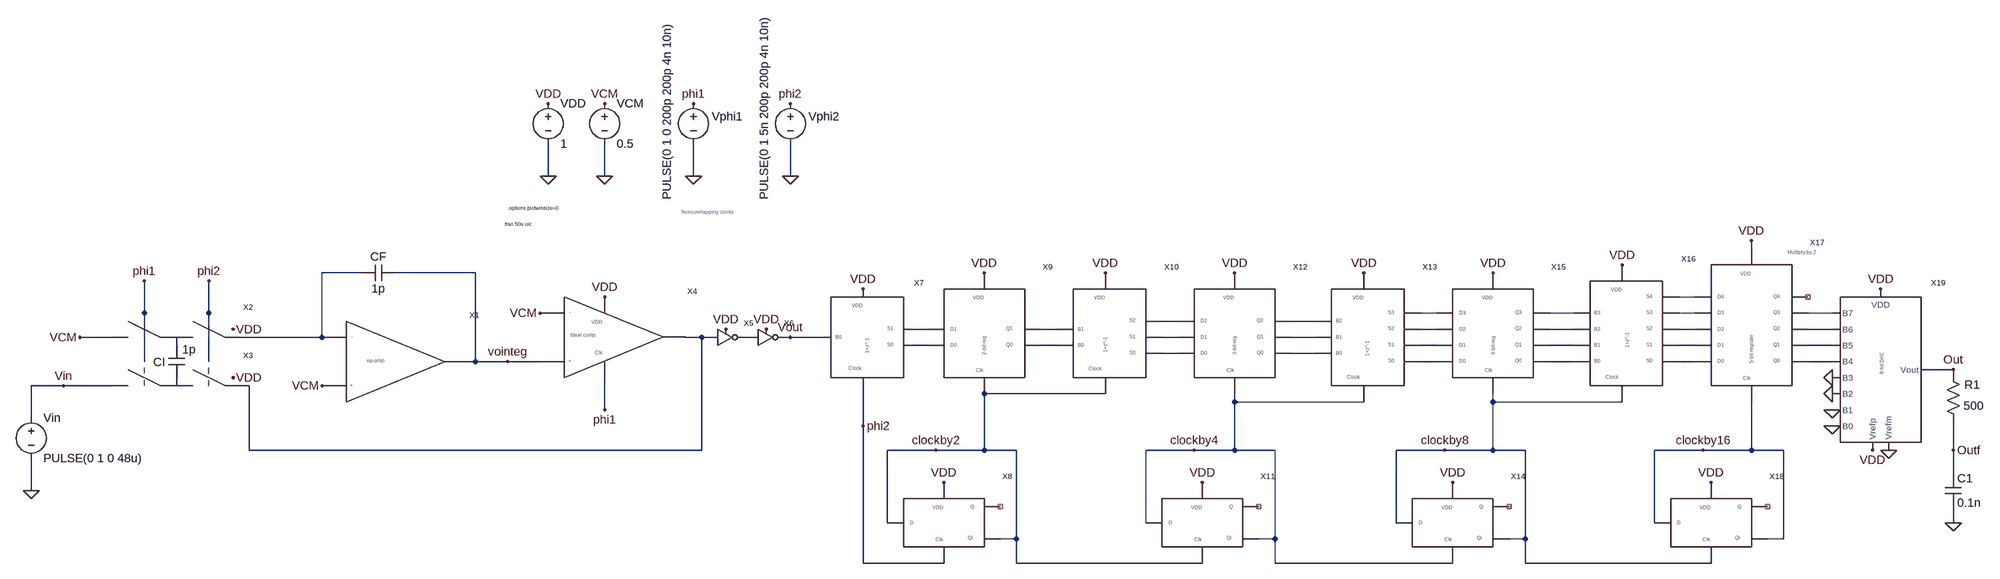
[diagram p0: schematic _Fig7_3_w_digital_filter_MSD.asc]
_Fig7_3_w_digital_filter_MSD.asc, the LTspice schematic file:
Version 4
SHEET 1 4592 696
WIRE 1744 -704 1744 -768
WIRE 1856 -704 1856 -768
WIRE 2032 -704 2032 -768
WIRE 2224 -704 2224 -768
WIRE 4128 -560 4128 -576
WIRE 1376 -512 1296 -512
WIRE 1600 -512 1440 -512
WIRE 4016 -464 3984 -464
WIRE 944 -432 944 -496
WIRE 1072 -432 1072 -496
WIRE 3504 -432 3472 -432
WIRE 3776 -432 3728 -432
WIRE 4016 -432 3984 -432
WIRE 4288 -432 4240 -432
WIRE 2992 -416 2960 -416
WIRE 3264 -416 3216 -416
WIRE 2496 -400 2464 -400
WIRE 2752 -400 2720 -400
WIRE 3504 -400 3472 -400
WIRE 3776 -400 3728 -400
WIRE 4016 -400 3984 -400
WIRE 4288 -400 4240 -400
WIRE 880 -384 816 -384
WIRE 1296 -384 1296 -512
WIRE 1296 -384 1136 -384
WIRE 2048 -384 2016 -384
WIRE 2080 -384 2048 -384
WIRE 2160 -384 2128 -384
WIRE 2224 -384 2208 -384
WIRE 2288 -384 2224 -384
WIRE 2992 -384 2960 -384
WIRE 3264 -384 3216 -384
WIRE 1008 -368 1008 -384
WIRE 2496 -368 2464 -368
WIRE 2752 -368 2720 -368
WIRE 3504 -368 3472 -368
WIRE 3776 -368 3728 -368
WIRE 4016 -368 3984 -368
WIRE 4288 -368 4240 -368
WIRE 2992 -352 2960 -352
WIRE 3264 -352 3216 -352
WIRE 944 -336 944 -432
WIRE 1072 -336 1072 -432
WIRE 1600 -336 1600 -512
WIRE 1600 -336 1584 -336
WIRE 1664 -336 1600 -336
WIRE 1728 -336 1664 -336
WIRE 3504 -336 3472 -336
WIRE 3776 -336 3728 -336
WIRE 4016 -336 3984 -336
WIRE 4288 -336 4240 -336
WIRE 4528 -320 4480 -320
WIRE 4528 -304 4528 -320
WIRE 784 -288 720 -288
WIRE 880 -288 784 -288
WIRE 1008 -288 1008 -304
WIRE 1152 -288 1136 -288
WIRE 2848 -272 2608 -272
WIRE 3104 -256 3104 -272
WIRE 3360 -256 3104 -256
WIRE 3616 -256 3616 -272
WIRE 3872 -256 3616 -256
WIRE 1856 -240 1856 -304
WIRE 720 -224 720 -288
WIRE 2368 -208 2368 -288
WIRE 1152 -160 1152 -288
WIRE 2048 -160 2048 -384
WIRE 2048 -160 1152 -160
WIRE 2512 -160 2416 -160
WIRE 2608 -160 2608 -272
WIRE 2608 -160 2512 -160
WIRE 2672 -160 2608 -160
WIRE 3024 -160 2928 -160
WIRE 3104 -160 3104 -256
WIRE 3104 -160 3024 -160
WIRE 3184 -160 3104 -160
WIRE 3520 -160 3424 -160
WIRE 3616 -160 3616 -256
WIRE 3616 -160 3520 -160
WIRE 3680 -160 3616 -160
WIRE 4032 -160 3936 -160
WIRE 4128 -160 4128 -256
WIRE 4128 -160 4032 -160
WIRE 4192 -160 4128 -160
WIRE 4528 -160 4528 -224
WIRE 4528 -112 4528 -160
WIRE 720 -80 720 -144
WIRE 2416 -16 2416 -160
WIRE 2928 -16 2928 -160
WIRE 3424 -16 3424 -160
WIRE 3936 -16 3936 -160
WIRE 4528 -16 4528 -48
WIRE 2672 16 2672 -160
WIRE 2672 16 2640 16
WIRE 3184 16 3184 -160
WIRE 3184 16 3152 16
WIRE 3680 16 3680 -160
WIRE 3680 16 3648 16
WIRE 4192 16 4192 -160
WIRE 4192 16 4160 16
WIRE 2368 64 2368 -208
WIRE 2528 64 2368 64
WIRE 2672 64 2672 16
WIRE 3040 64 2672 64
WIRE 3184 64 3184 16
WIRE 3536 64 3184 64
WIRE 3680 64 3680 16
WIRE 4048 64 3680 64
FLAG 720 -80 0
FLAG 784 -288 Vin
FLAG 2032 -704 0
FLAG 2032 -848 phi1
FLAG 1744 -704 0
FLAG 1744 -848 VDD
FLAG 1120 -400 VDD
FLAG 1120 -304 VDD
FLAG 944 -496 phi1
FLAG 1072 -496 phi2
FLAG 1296 -288 VCM
FLAG 816 -384 VCM
FLAG 2224 -704 0
FLAG 2224 -848 phi2
FLAG 1856 -704 0
FLAG 1856 -848 VCM
FLAG 1728 -432 VCM
FLAG 1856 -464 VDD
FLAG 1856 -240 phi1
FLAG 1664 -336 vointeg
FLAG 2096 -400 VDD
FLAG 2176 -400 VDD
FLAG 2368 -480 VDD
FLAG 2528 -96 VDD
FLAG 2512 -160 clockby2
FLAG 2608 -512 VDD
FLAG 2848 -512 VDD
FLAG 3040 -96 VDD
FLAG 3024 -160 clockby4
FLAG 3104 -512 VDD
FLAG 3360 -512 VDD
FLAG 3536 -96 VDD
FLAG 3520 -160 clockby8
FLAG 3616 -512 VDD
FLAG 3872 -528 VDD
FLAG 4048 -96 VDD
FLAG 4032 -160 clockby16
FLAG 4128 -576 VDD
FLAG 4384 -480 VDD
FLAG 4368 -160 VDD
FLAG 4400 -160 0
FLAG 4288 -240 0
FLAG 4288 -208 0
FLAG 4528 -320 Out
FLAG 4528 -16 0
FLAG 4528 -160 Outf
FLAG 4288 -272 0
FLAG 2224 -384 Vout
FLAG 2368 -208 phi2
FLAG 4288 -304 0
SYMBOL voltage 720 -240 R0
WINDOW 123 0 0 Left 2
WINDOW 39 0 0 Left 2
SYMATTR InstName Vin
SYMATTR Value PULSE(0 1 0 48u)
SYMBOL voltage 2032 -864 R0
WINDOW 0 36 42 Left 2
WINDOW 3 -52 207 VLeft 2
WINDOW 123 0 0 Left 2
WINDOW 39 0 0 Left 2
SYMATTR InstName Vphi1
SYMATTR Value PULSE(0 1 0 200p 200p 4n 10n)
SYMBOL voltage 1744 -864 R0
WINDOW 123 0 0 Left 2
WINDOW 39 0 0 Left 2
SYMATTR InstName VDD
SYMATTR Value 1
SYMBOL switches_2 880 -368 R0
SYMATTR InstName X2
SYMBOL switches_2 880 -272 R0
SYMATTR InstName X3
SYMBOL cap 1376 -496 R270
WINDOW 0 32 32 VTop 2
WINDOW 3 0 32 VBottom 2
SYMATTR InstName CF
SYMATTR Value 1p
SYMBOL cap 992 -368 R0
WINDOW 0 -30 33 Left 2
WINDOW 3 27 8 Left 2
SYMATTR InstName CI
SYMATTR Value 1p
SYMBOL voltage 2224 -864 R0
WINDOW 0 36 42 Left 2
WINDOW 3 -52 207 VLeft 2
WINDOW 123 0 0 Left 2
WINDOW 39 0 0 Left 2
SYMATTR InstName Vphi2
SYMATTR Value PULSE(0 1 5n 200p 200p 4n 10n)
SYMBOL voltage 1856 -864 R0
WINDOW 123 0 0 Left 2
WINDOW 39 0 0 Left 2
SYMATTR InstName VCM
SYMATTR Value 0.5
SYMBOL Ideal_clocked_comparator 1776 -384 R0
SYMATTR InstName X4
SYMBOL inverter 2080 -384 R0
SYMATTR InstName X5
SYMBOL inverter 2160 -384 R0
SYMATTR InstName X6
SYMBOL op_amp 1344 -336 R0
SYMATTR InstName X1
SYMBOL 1_bit_averager 2304 -304 R0
SYMATTR InstName X7
SYMBOL DFF 2448 32 R0
SYMATTR InstName X8
SYMBOL 2_bit_register 2528 -304 R0
SYMATTR InstName X9
SYMBOL 2_bit_averager 2784 -304 R0
SYMATTR InstName X10
SYMBOL DFF 2960 32 R0
SYMATTR InstName X11
SYMBOL 3_bit_register 3024 -304 R0
SYMATTR InstName X12
SYMBOL 3_bit_averager 3296 -288 R0
SYMATTR InstName X13
SYMBOL DFF 3456 32 R0
SYMATTR InstName X14
SYMBOL 4_bit_register 3536 -304 R0
SYMATTR InstName X15
SYMBOL 4_bit_averager 3808 -288 R0
SYMATTR InstName X16
SYMBOL 5_bit_register 4048 -288 R0
SYMATTR InstName X17
SYMBOL DFF 3968 32 R0
SYMATTR InstName X18
SYMBOL Ideal_8_bit_DAC 4304 -176 R0
SYMATTR InstName X19
SYMBOL res 4544 -208 R180
WINDOW 0 -37 82 Left 2
WINDOW 3 -45 40 Left 2
SYMATTR InstName R1
SYMATTR Value 500
SYMBOL cap 4512 -112 R0
SYMATTR InstName C1
SYMATTR Value 0.1n
TEXT 1656 -608 Left 0 !.tran 50u uic
TEXT 2008 -632 Left 0 ;Nonoverlapping clocks
TEXT 1664 -640 Left 0 !.options plotwinsize=0
TEXT 4200 -552 Left 0 ;Multiply by 2

The netlist it stands for:
* _Fig7_3_w_digital_filter_MSD.asc
Vin Vin 0 PULSE(0 1 0 48u)
Vphi1 phi1 0 PULSE(0 1 0 200p 200p 4n 10n)
VDD VDD 0 1
XX2 VCM phi1 phi2 N001 VDD N019 switches_2  ; pins P1 clk1 Clk2 P3 VDD P2
XX3 Vin phi1 phi2 N015 VDD N032 switches_2  ; pins P1 clk1 Clk2 P3 VDD P2
CF N001 vointeg 1p
CI N019 N032 1p
Vphi2 phi2 0 PULSE(0 1 5n 200p 200p 4n 10n)
VCM VCM 0 0.5
XX4 VCM vointeg N015 VDD phi1 Ideal_clocked_comparator  ; pins Vinm Vinp Vout VDD Clock
XX5 N015 N016 VDD inverter  ; pins In Out VDD
XX6 N016 Vout VDD inverter  ; pins In Out VDD
XX1 N001 VCM vointeg op_amp  ; pins Vinm Vinp Out
XX7 Vout N020 N009 phi2 VDD 1_bit_averager  ; pins B0 S0 S1 Clock VDD
XX8 clockby2 phi2 NC_01 clockby2 VDD DFF  ; pins D Clk Q Qi VDD
XX9 N020 N009 N021 N010 clockby2 VDD 2_bit_register  ; pins D0 D1 Q0 Q1 Clk VDD
XX10 N021 N010 N026 N017 N007 clockby2 VDD 2_bit_averager  ; pins B0 B1 S0 S1 S2 Clock VDD
XX11 clockby4 clockby2 NC_02 clockby4 VDD DFF  ; pins D Clk Q Qi VDD
XX12 N026 N017 N007 N027 N018 N008 clockby4 VDD 3_bit_register  ; pins D0 D1 D2 Q0 Q1 Q2 Clk VDD
XX13 N027 N018 N008 N028 N022 N011 N003 clockby4 VDD 3_bit_averager  ; pins B0 B1 B2 S0 S1 S2 S3 Clock VDD
XX14 clockby8 clockby4 NC_03 clockby8 VDD DFF  ; pins D Clk Q Qi VDD
XX15 N028 N022 N011 N003 N029 N023 N012 N004 clockby8 VDD 4_bit_register  ; pins D0 D1 D2 D3 Q0 Q1 Q2 Q3 Clk VDD
XX16 N029 N023 N012 N004 N030 N024 N013 N005 N002 clockby8 VDD 4_bit_averager  ; pins B0 B1 B2 B3 S0 S1 S2 S3 S4 Clock VDD
XX17 N030 N024 N013 N005 N002 N031 N025 N014 N006 NC_04 clockby16 VDD 5_bit_register  ; pins D0 D1 D2 D3 D4 Q0 Q1 Q2 Q3 Q4 Clk VDD
XX18 clockby16 clockby8 NC_05 clockby16 VDD DFF  ; pins D Clk Q Qi VDD
XX19 N006 N014 N025 N031 0 0 0 0 Out VDD 0 VDD Ideal_8_bit_DAC  ; pins B7 B6 B5 B4 B3 B2 B1 B0 Vout Vrefp Vrefm VDD
R1 Outf Out 500
C1 Outf 0 0.1n
.tran 50u uic
* Nonoverlapping clocks
.options plotwinsize=0
* Multiply by 2
.backanno
.end